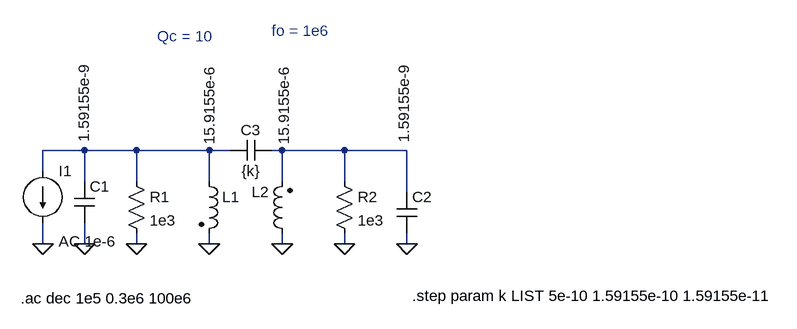
[diagram p0: schematic Doble_acopla_C.asc]
Doble_acopla_C.asc, the LTspice schematic file:
Version 4
SHEET 1 880 680
WIRE -768 16 -832 16
WIRE -688 16 -768 16
WIRE -576 16 -688 16
WIRE -544 16 -576 16
WIRE -464 16 -480 16
WIRE -368 16 -464 16
WIRE -272 16 -368 16
WIRE -832 48 -832 16
WIRE -768 64 -768 16
WIRE -688 64 -688 16
WIRE -576 64 -576 16
WIRE -464 64 -464 16
WIRE -368 64 -368 16
WIRE -272 80 -272 16
WIRE -832 160 -832 128
WIRE -768 160 -768 128
WIRE -688 160 -688 144
WIRE -576 160 -576 144
WIRE -464 160 -464 144
WIRE -368 160 -368 144
WIRE -272 160 -272 144
FLAG -832 160 0
FLAG -768 160 0
FLAG -688 160 0
FLAG -576 160 0
FLAG -464 160 0
FLAG -368 160 0
FLAG -272 160 0
SYMBOL ind2 -592 48 R0
WINDOW 3 131 -40 VLeft 2
SYMATTR InstName L1
SYMATTR Value 15.9155e-6
SYMATTR Type ind
SYMBOL ind2 -448 160 R180
WINDOW 0 36 80 Left 2
WINDOW 3 128 152 VRight 2
SYMATTR InstName L2
SYMATTR Value 15.9155e-6
SYMATTR Type ind
SYMBOL res -704 48 R0
SYMATTR InstName R1
SYMATTR Value 1e3
SYMBOL res -384 48 R0
SYMATTR InstName R2
SYMATTR Value 1e3
SYMBOL cap -784 64 R0
WINDOW 3 15 -60 VLeft 2
SYMATTR InstName C1
SYMATTR Value 1.59155e-9
SYMBOL cap -288 80 R0
WINDOW 3 11 -75 VLeft 2
SYMATTR InstName C2
SYMATTR Value 1.59155e-9
SYMBOL current -832 48 R0
WINDOW 123 24 108 Left 2
WINDOW 39 0 0 Left 2
SYMATTR InstName I1
SYMATTR Value ""
SYMATTR Value2 AC 1e-6
SYMBOL cap -480 0 R90
WINDOW 0 0 32 VBottom 2
WINDOW 3 32 32 VTop 2
SYMATTR InstName C3
SYMATTR Value {k}
TEXT -656 -160 Left 2 ;Qc = 10
TEXT -480 -168 Left 2 ;fo = 1e6
TEXT -866 244 Left 2 !.ac dec 1e5 0.3e6 100e6
TEXT -264 240 Left 2 !.step param k LIST 5e-10 1.59155e-10 1.59155e-11

The netlist it stands for:
* Doble_acopla_C.asc
L1 N001 0 15.9155e-6
L2 0 N002 15.9155e-6
R1 N001 0 1e3
R2 N002 0 1e3
C1 N001 0 1.59155e-9
C2 N002 0 1.59155e-9
I1 N001 0 AC 1e-6
C3 N002 N001 {k}
* Qc = 10
* fo = 1e6
.ac dec 1e5 0.3e6 100e6
.step param k LIST 5e-10 1.59155e-10 1.59155e-11
.backanno
.end